# EAGLE design io (EAGLE 9.3.0)
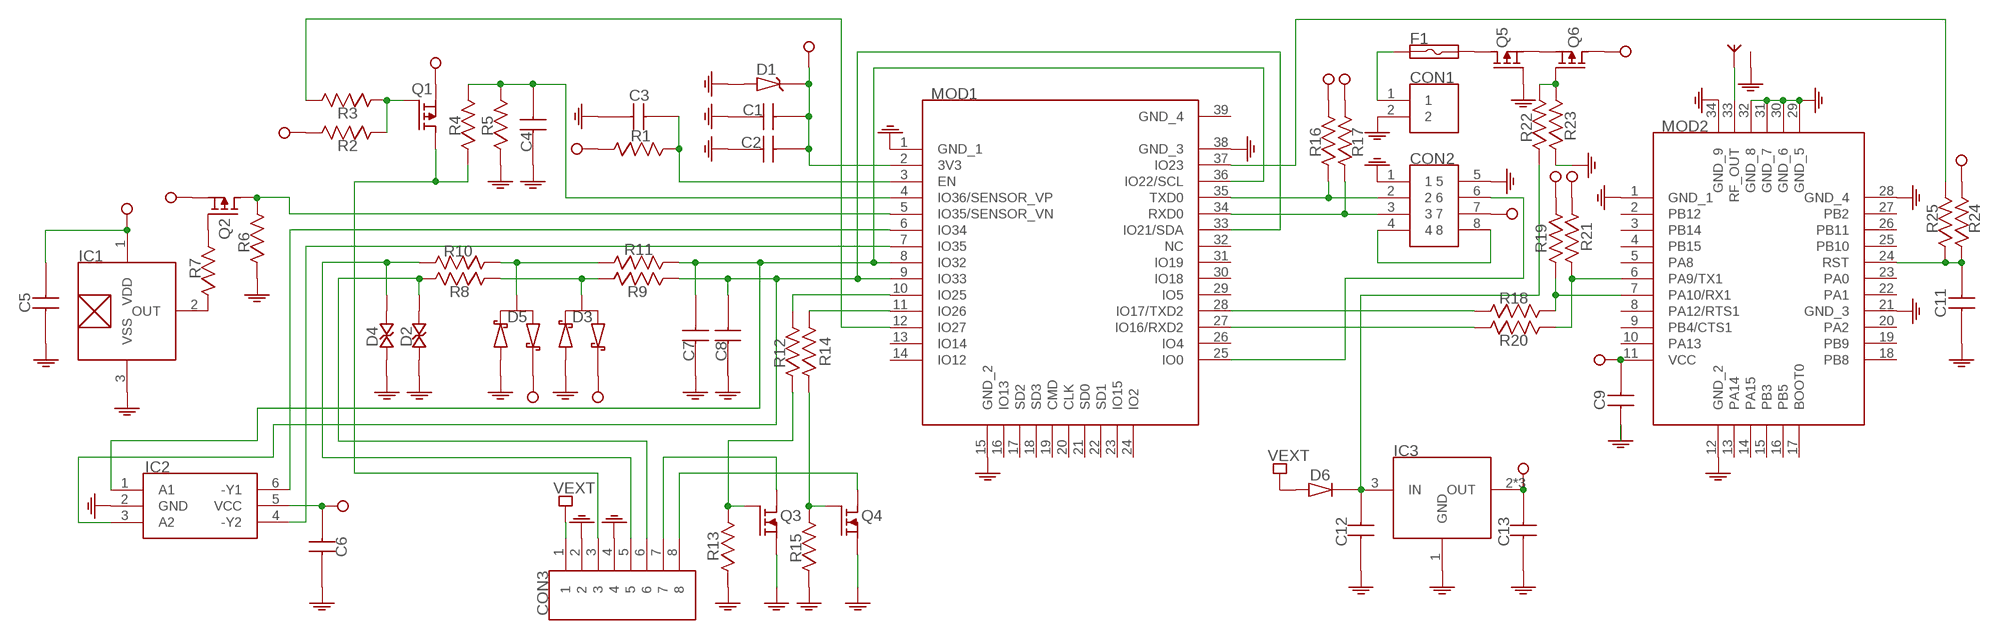
[diagram p0: schematic, sheet 1]

## Parts
ANT1  SMA-RF  [SMA-RF]
C1  CAPACITOR-0805  [0805]
C2  CAPACITOR-0603  [0603]
C3  CAPACITOR-0603  [0603]
C4  CAPACITOR-0603  [0603]
C5  CAPACITOR-0603  [0603]
C6  CAPACITOR-0603  [0603]
C7  CAPACITOR-0603  [0603]
C8  CAPACITOR-0603  [0603]
C9  CAPACITOR-0603  [0603]
C11  CAPACITOR-0603  [0603]
C12  CAPACITOR-0805  [0805]
C13  CAPACITOR-0805  [0805]
CON1  JST-PH-2-2.0MM  [JST-PH-2-2.0MM]
CON2  HEADER-8P-2R-DIP-2_0MM  [HEADER-8P-2R-DIP-2_0MM]
CON3  CON-89-3_81-PLUG  [CON-8P-3_81-PLUG]
D1  ZENER-SOD123  [SOD123-DIODE]
D2  TVS-DIODE-SMA  [DO-214AC-SMA]
D3  SCHOTTKY-SERIE-3P  [SOT23-3]
D4  TVS-DIODE-SMA  [DO-214AC-SMA]
D5  SCHOTTKY-SERIE-3P  [SOT23-3]
D6  DIODE-DO-214AC-SMA  [DO-214AC-SMA-DIODE]
F1  FUSE-0805  [0805]
IC1  S-5712-SOT23-3  [SOT23-3]
IC2  NL27WZ04DTT1G  [SOT23-6]
IC3  VREG-SOT-223  [SOT-223]
MOD1  ESP32-WROOM-32D  [ESP32-WROOM-32D]
MOD2  RAK811  [RAK811]
Q1  P-MOSFET  [SOT23-3]
Q2  P-MOSFET  [SOT23-3]
Q3  N-MOSFET  [SOT23-3]
Q4  N-MOSFET  [SOT23-3]
Q5  P-MOSFET  [SOT23-3]
Q6  P-MOSFET  [SOT23-3]
R1  RESISTOR-0603  [0603]
R2  RESISTOR-0603  [0603]
R3  RESISTOR-0603  [0603]
R4  RESISTOR-0603  [0603]
R5  RESISTOR-0603  [0603]
R6  RESISTOR-0603  [0603]
R7  RESISTOR-0603  [0603]
R8  RESISTOR-0805  [0805]
R9  RESISTOR-0603  [0603]
R10  RESISTOR-0805  [0805]
R11  RESISTOR-0603  [0603]
R12  RESISTOR-0603  [0603]
R13  RESISTOR-0603  [0603]
R14  RESISTOR-0603  [0603]
R15  RESISTOR-0603  [0603]
R16  RESISTOR-0603  [0603]
R17  RESISTOR-0603  [0603]
R18  RESISTOR-0603  [0603]
R19  RESISTOR-0603  [0603]
R20  RESISTOR-0603  [0603]
R21  RESISTOR-0603  [0603]
R22  RESISTOR-0603  [0603]
R23  RESISTOR-0603  [0603]
R24  RESISTOR-0603  [0603]
R25  RESISTOR-0603  [0603]

## Nets
GND: ANT1.2(GND) ANT1.3(GND) ANT1.4(GND) ANT1.5(GND) C1.1 C2.1 C3.1 C4.1 C5.1 C6.2 C7.1 C8.1 C9.1 C11.1 C12.1 C13.1 CON1.2 CON2.1 CON2.5 CON3.2 CON3.4 D1.2(A) D2.1 D3.1 D4.1 D5.1 IC1.3(VSS) IC2.2(GND) IC3.1(GND) MOD1.1(GND_1) MOD1.15(GND_2) MOD1.38(GND_3) MOD2.1(GND_1) MOD2.12(GND_2) MOD2.21(GND_3) MOD2.28(GND_4) MOD2.29(GND_5) MOD2.30(GND_6) MOD2.31(GND_7) MOD2.32(GND_8) MOD2.34(GND_9) Q3.2(S) Q4.2(S) Q5.1(G) R5.1 R6.1 R13.1 R15.1 R23.1
N$1: C3.2 MOD1.3(EN) R1.2
N$2: ANT1.1(ANT) MOD2.33(RF_OUT)
N$3: MOD2.6(PA9/TX1) R20.2 R21.2
N$4: MOD2.7(PA10/RX1) R18.2 R19.2
N$5: MOD1.37(IO23) R25.2
N$6: MOD1.28(IO17/TXD2) R18.1
N$7: MOD1.27(IO16/RXD2) R20.1
N$8: CON2.2 MOD1.35(TXD0) R16.1
N$9: CON2.3 MOD1.34(RXD0) R17.1
N$10: CON2.4 CON2.8
N$11: CON2.6 MOD1.25(IO0)
N$12: CON1.1 F1.1
N$13: MOD1.5(IO35/SENSOR_VN) Q2.3(D) R6.2
N$14: CON3.7 Q3.3(D)
N$15: C7.2 IC2.1(A1) MOD1.8(IO32) MOD1.36(IO22/SCL) R11.2
N$16: CON3.3 Q1.3(D) R4.1
N$17: C11.2 MOD2.24(RST) R24.1 R25.1
N$18: Q1.1(G) R2.1 R3.1
N$19: F1.2 Q5.3(D)
N$20: C8.2 IC2.3(A2) MOD1.9(IO33) MOD1.33(IO21/SDA) R9.2
N$21: Q2.1(G) R7.2
N$23: IC2.4(-Y2) MOD1.7(IO35)
N$24: D5.3 R10.1 R11.1
N$25: D3.3 R8.1 R9.1
N$26: MOD1.11(IO26) R14.2
N$27: MOD1.10(IO25) R12.2
N$28: Q4.1(G) R14.1 R15.2
N$29: IC2.6(-Y1) MOD1.6(IO34)
N$30: CON3.8 Q4.3(D)
N$31: Q5.2(S) Q6.2(S)
N$32: Q3.1(G) R12.1 R13.2
N$33: MOD1.12(IO27) R3.2
N$34: IC1.2(OUT) R7.1
N$36: C12.2 D6.1(K) IC3.3(IN) R22.1
N$37: Q6.1(G) R22.2 R23.2
N$38: C4.2 MOD1.4(IO36/SENSOR_VP) R4.2 R5.2
N$39: CON3.6 D2.2 R8.2
N$40: CON3.5 D4.2 R10.2
VCC: C1.2 C2.2 C5.2 C6.1 C9.2 C13.2 CON2.7 D1.1(K) D3.2 D5.2 IC1.1(VDD) IC2.5(VCC) IC3.2(OUT) IC3.4(OUT) IC3.5(OUT) MOD1.2(3V3) MOD2.11(VCC) Q1.2(S) Q2.2(S) Q6.3(D) R1.1 R2.2 R16.2 R17.2 R19.1 R21.1 R24.2
VEXT: CON3.1 D6.2(A)
Unconnected: MOD1.13(IO14) MOD1.14(IO12) MOD1.16(IO13) MOD1.17(SD2) MOD1.18(SD3) MOD1.19(CMD) MOD1.20(CLK) MOD1.21(SD0) MOD1.22(SD1) MOD1.23(IO15) MOD1.24(IO2) MOD1.26(IO4) MOD1.29(IO5) MOD1.30(IO18) MOD1.31(IO19) MOD1.32(NC) MOD2.2(PB12) MOD2.3(PB14) MOD2.4(PB15) MOD2.5(PA8) MOD2.8(PA12/RTS1) MOD2.9(PB4/CTS1) MOD2.10(PA13) MOD2.13(PA14) MOD2.14(PA15) MOD2.15(PB3) MOD2.16(PB5) MOD2.17(BOOT0) MOD2.18(PB8) MOD2.19(PB9) MOD2.20(PA2) MOD2.22(PA1) MOD2.23(PA0) MOD2.25(PB10) MOD2.26(PB11) MOD2.27(PB2)

## Power pins joined to a net without a drawn wire
GND_4: MOD1.39(GND_4)

## Library data of the parts
ANT1 = SamacSys_Parts:SMA-RF
C1 C12 C13 = SamacSys_Parts:CAPACITOR-0805
C2-C9 C11 = SamacSys_Parts:CAPACITOR-0603
CON1 = SamacSys_Parts:JST-PH-2-2.0MM
CON2 = SamacSys_Parts:HEADER-8P-2R-DIP-2_0MM
CON3 = SamacSys_Parts:CON-89-3_81-PLUG
D1 = SamacSys_Parts:ZENER-SOD123
D2 D4 = SamacSys_Parts:TVS-DIODE-SMA
D3 D5 = SamacSys_Parts:SCHOTTKY-SERIE-3P
D6 = SamacSys_Parts:DIODE-DO-214AC-SMA
F1 = SamacSys_Parts:FUSE-0805
IC1 = SamacSys_Parts:S-5712-SOT23-3
IC2 = SamacSys_Parts:NL27WZ04DTT1G
IC3 = SamacSys_Parts:VREG-SOT-223
MOD1 = SamacSys_Parts:ESP32-WROOM-32D
MOD2 = SamacSys_Parts:RAK811
Q1 Q2 Q5 Q6 = SamacSys_Parts:P-MOSFET
Q3 Q4 = SamacSys_Parts:N-MOSFET
R1-R7 R9 R11-R25 = SamacSys_Parts:RESISTOR-0603
R8 R10 = SamacSys_Parts:RESISTOR-0805

## Board
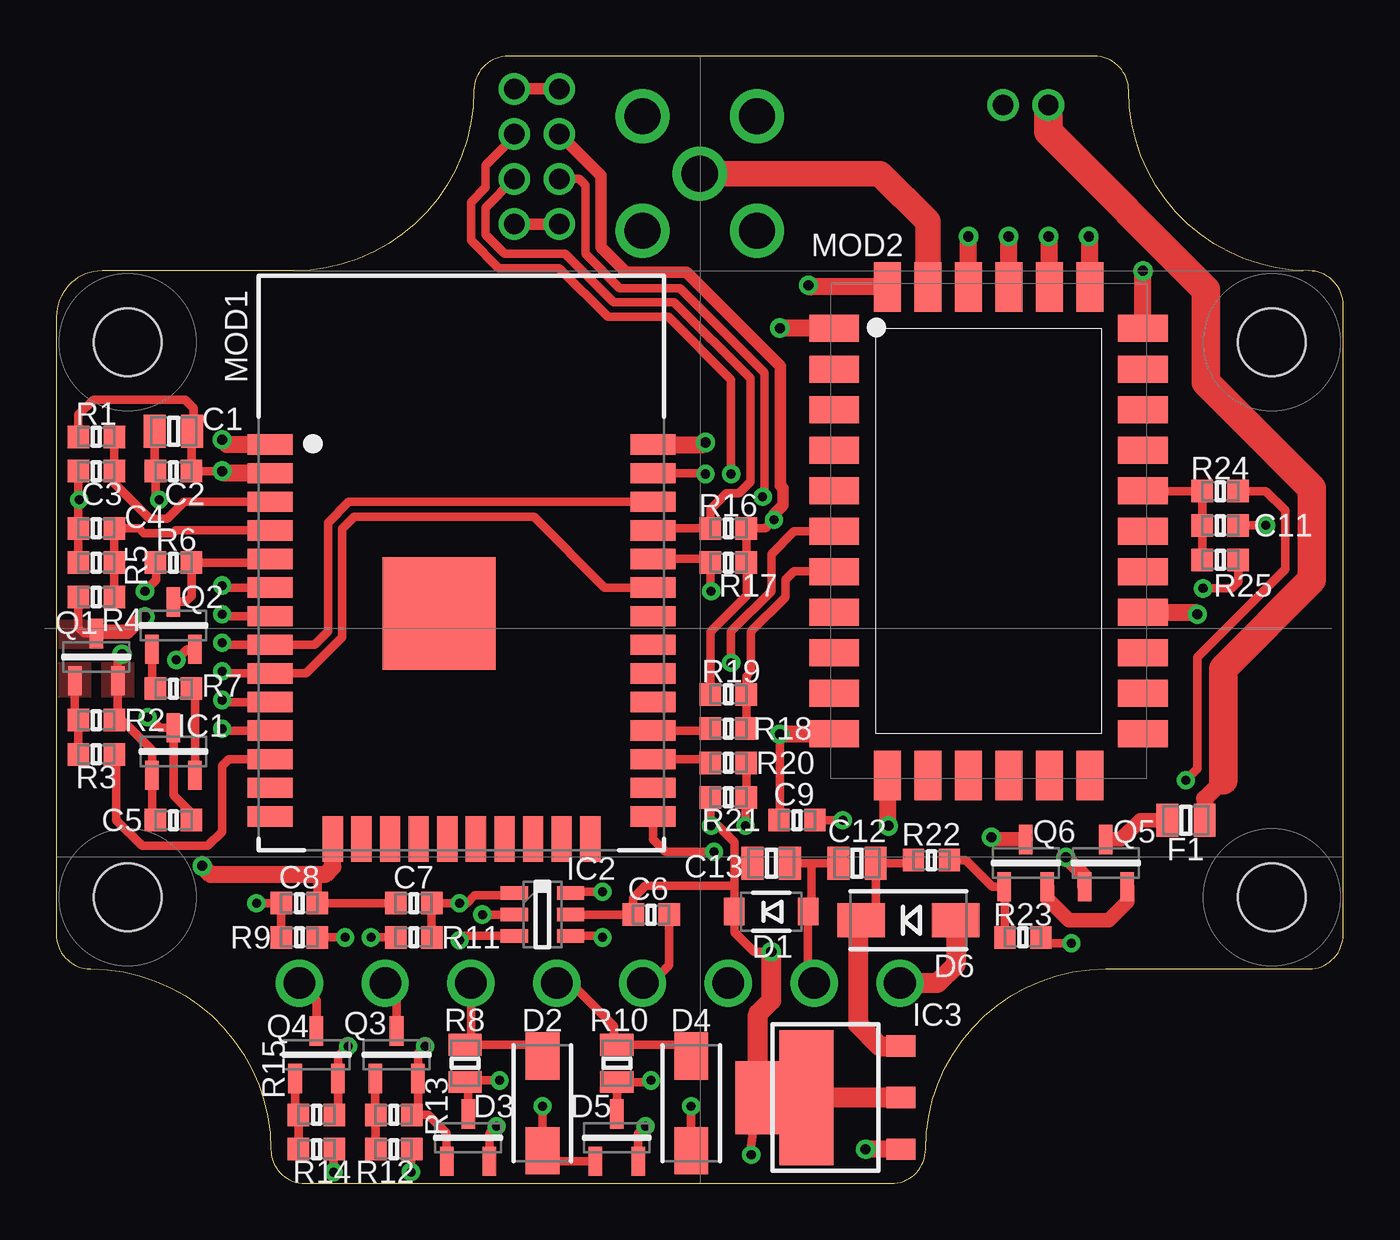
[diagram p1: board, top side]
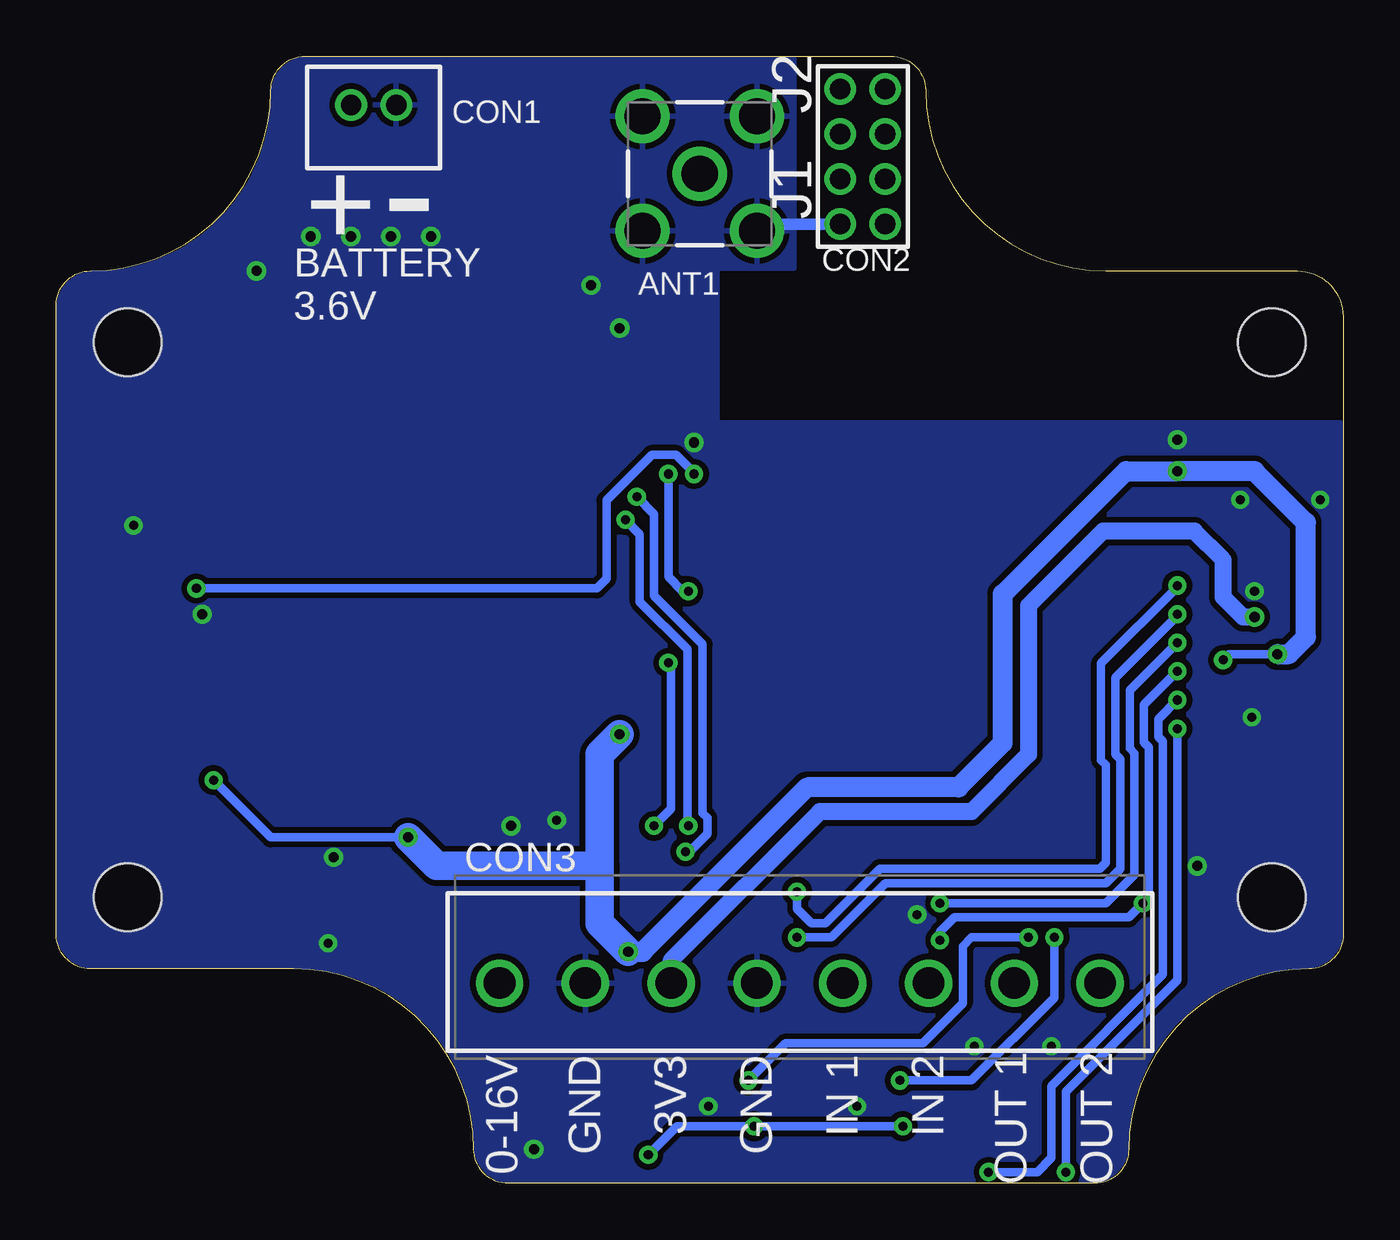
[diagram p2: board, bottom side, seen from below]

Size 57.15 x 50.04 mm. Coordinates in mm from the lower left corner, seen from the top.
Outline: 0,38.48 0,11.05 arc90 1.52,9.53 arc-90 9.53,1.52 arc90 11.05,0 37.08,0 arc90 38.61,1.52 arc-90 46.61,9.53 55.63,9.53 arc90 57.15,11.05 57.15,38.99 arc90 55.63,40.51 arc-90 47.62,48.51 arc90 46.1,50.04 20.07,50.04 arc90 18.54,48.51 arc-90 10.54,40.51 2.03,40.51 arc90 0,38.48
Copper layers (1*16): Top 0.035mm / dielectric 1.5mm / Bottom 0.035mm
Design rules "default": minimum track width 15mil, minimum drill 0.35mm, track to track 10mil, track to pad 10mil, pad to pad 10mil, via to via 10mil, smd to smd 0mil, copper to edge 0mil, drill to drill 6mil, minimum pad ring 10mil, minimum via ring 8mil, stop-mask expansion 4mil, vias tented up to drill 25mil, thermal gap 10mil
Holes 3 mm at 3.17,37.34 53.98,37.34 53.98,12.7 3.17,12.7

### Footprints (pad centres in the part's own frame; a part is rotated, then mirrored left to right if it is on the bottom)
SMA-RF = drill 1.6: 1 0,0; 2 -2.54,2.54; 3 -2.54,-2.54; 4 2.54,-2.54; 5 2.54,2.54
0805 = smd 0.97 x 1.47: 1 -0.83,0; 2 0.83,0
0603 = smd 0.95 x 1: 1 -0.8,0; 2 0.8,0
JST-PH-2-2.0MM = drill 0.9: 1 -1,0; 2 1,0
HEADER-8P-2R-DIP-2_0MM = drill 0.9: 1 -3,-1; 2 -1,-1; 3 1,-1; 4 3,-1; 5 -3,1; 6 -1,1; 7 1,1; 8 3,1
CON-8P-3_81-PLUG = drill 1.4: 1 -13.335,0; 2 -9.525,0; 3 -5.715,0; 4 -1.905,0; 5 1.905,0; 6 5.715,0; 7 9.525,0; 8 13.335,0
SOD123-DIODE = smd 0.91 x 1.22: 1 -1.635,0; 2 1.635,0
DO-214AC-SMA = smd 2.1 x 1.5: 1 -2.1,0; 2 2.1,0
SOT23-3 = smd 1.3 x 0.6: 1 -1.05,0.95; 2 -1.05,-0.95; 3 1.05,0
DO-214AC-SMA-DIODE = smd 2.1 x 1.5: 1 -2.1,0; 2 2.1,0
SOT23-6 = smd 1.2 x 0.6: 1 -1.25,0.95; 2 -1.25,0; 3 -1.25,-0.95; 4 1.25,-0.95; 5 1.25,0; 6 1.25,0.95
SOT-223 = smd 1.3 x 0.95: 1 -3.35,2.29; 2 -3.35,0; 3 -3.35,-2.29 | smd 2 x 3.25: 4 3,0 | smd 2.4 x 6: 5 0.85,0
ESP32-WROOM-32D = smd 2 x 0.9: 1 -8.537,8.292; 2 -8.537,7.022; 3 -8.537,5.752; 4 -8.537,4.482; 5 -8.537,3.212; 6 -8.537,1.942; 7 -8.537,0.672; 8 -8.537,-0.598; 9 -8.537,-1.868; 10 -8.537,-3.138; 11 -8.537,-4.408; 12 -8.537,-5.678; 13 -8.537,-6.948; 14 -8.537,-8.218; 25 8.463,-8.218; 26 8.463,-6.948; 27 8.463,-5.678; 28 8.463,-4.408; 29 8.463,-3.138; 30 8.463,-1.868; 31 8.463,-0.598; 32 8.463,0.672; 33 8.463,1.942; 34 8.463,3.212; 35 8.463,4.482; 36 8.463,5.752; 37 8.463,7.022; 38 8.463,8.292 | smd 0.9 x 2: 15 -5.752,-9.218; 16 -4.482,-9.218; 17 -3.212,-9.218; 18 -1.942,-9.218; 19 -0.672,-9.218; 20 0.598,-9.218; 21 1.868,-9.218; 22 3.138,-9.218; 23 4.408,-9.218; 24 5.678,-9.218 | smd 5 x 5: 39 -1.037,0.792
RAK811 = smd 2.2 x 1.2: 1 -6.85,9; 2 -6.85,7.2; 3 -6.85,5.4; 4 -6.85,3.6; 5 -6.85,1.8; 6 -6.85,0; 7 -6.85,-1.8; 8 -6.85,-3.6; 9 -6.85,-5.4; 10 -6.85,-7.2; 11 -6.85,-9; 18 6.85,-9; 19 6.85,-7.2; 20 6.85,-5.4; 21 6.85,-3.6; 22 6.85,-1.8; 23 6.85,0; 24 6.85,1.8; 25 6.85,3.6; 26 6.85,5.4; 27 6.85,7.2; 28 6.85,9 | smd 1.2 x 2.2: 12 -4.5,-10.85; 13 -2.7,-10.85; 14 -0.9,-10.85; 15 0.9,-10.85; 16 2.7,-10.85; 17 4.5,-10.85; 29 4.5,10.85; 30 2.7,10.85; 31 0.9,10.85; 32 -0.9,10.85; 33 -2.7,10.85; 34 -4.5,10.85

### Placement (x,y rotation side)
ANT1  28.57,44.83 0 bottom
C1  5.21,33.4 0 top
C2  5.21,31.62 0 top
C3  1.78,31.62 0 top
C4  1.78,29.08 0 top
C5  5.21,16.13 180 top
C6  26.42,11.94 0 top
C7  15.88,12.45 0 top
C8  10.79,12.45 180 top
C9  32.89,16.13 180 top
C11  51.69,29.21 180 top
C12  35.56,14.22 0 top
C13  31.75,14.22 180 top
CON1  43.05,47.88 0 bottom
CON2  21.34,45.59 90 bottom
CON3  24.13,8.89 0 bottom
D1  31.75,12.06 0 top
D2  21.59,3.56 90 top
D3  18.29,2.03 90 top
D4  28.19,3.56 90 top
D5  24.89,2.03 90 top
D6  37.85,11.68 0 top
F1  50.16,16.13 180 top
IC1  5.21,19.18 90 top
IC2  21.59,11.94 0 top
IC3  34.16,3.81 180 top
MOD1  18.03,24.51 0 top
MOD2  41.4,28.96 0 top
Q1  1.78,23.37 90 top
Q2  5.21,24.77 90 top
Q3  15.11,5.71 90 top
Q4  11.56,5.71 90 top
Q5  46.61,14.22 90 top
Q6  43.05,14.22 90 top
R1  1.78,33.15 0 top
R2  1.78,20.57 0 top
R3  1.78,19.05 0 top
R4  1.78,26.04 0 top
R5  1.78,27.56 0 top
R6  5.21,27.56 0 top
R7  5.21,21.97 180 top
R8  18.16,5.33 90 top
R9  10.79,10.92 180 top
R10  24.89,5.33 90 top
R11  15.88,10.92 0 top
R12  14.99,1.52 0 top
R13  14.99,3.05 180 top
R14  11.56,1.52 0 top
R15  11.56,3.05 180 top
R16  29.84,29.08 0 top
R17  29.84,27.56 0 top
R18  29.84,20.19 0 top
R19  29.84,21.72 0 top
R20  29.84,18.67 0 top
R21  29.84,17.14 0 top
R22  38.86,14.35 0 top
R23  42.93,10.92 180 top
R24  51.69,30.73 0 top
R25  51.69,27.69 0 top

### Tracks (layer width: path | path; a pad name or v marks a point on that pad's centre or on a via)
GND  (via drill 0.4, 0.45)
  Top 0.381: R5.1 C4.1 0.98,30.39 | C1.1 4.38,31.65 C2.1 4.41,30.52 v4.57,30.35 | R15.1 12.51,3.2 Q4.2 12.51,5.65 v12.95,6.1 | C7.1 C8.1 11.6,13.72 | IC2.2 v18.92,11.94 | C6.2 27.22,9.69 26.42,8.89 CON3.4 | CON3.2 33.38,9.16 D1.2 33.53,12.21 33.53,14.22 | C3.1 0.98,30.39 | 0.98,30.39 v1.02,30.35 | R6.1 4.45,27.52 4.45,26.8 v3.94,26.29 | C5.1 6.01,16.44 5.21,17.24 IC1.3 4.59,20.23 4.42,20.41 4.36,20.41 v4.06,20.7 | MOD2.1 35.16,37.96 35.31,38.1 | v16.38,6.1 16.06,5.78 Q3.2 16.06,3.33 R13.1 16.51,3.05 17.34,2.22 D3.1 | D5.1 22.06,0.98 D2.1 v21.59,3.43 | D4.1 v28.19,3.43 | v34.92,16.13 C9.1 | C13.1 33.53,14.22 | 33.53,14.22 C12.1 | C11.1 v53.72,29.21 | R23.1 43.98,10.67 v45.09,10.67
  Top 0.508: CON2.1 CON2.5
  Top 0.635: Q5.1 45.66,13.65 v44.83,14.48
  Top 0.762: MOD1.1 7.58,32.8 v7.37,33.02 | v6.48,14.1 6.86,13.72 11.6,13.72 11.94,13.72 12.28,14.06 MOD1.15 | MOD1.38 28.74,32.8 v28.83,32.89 | IC3.1 v35.95,1.52 v35.94,1.52 | MOD2.12 36.9,15.93 v36.96,15.88 | MOD2.1 34.53,37.97 v32.13,37.97 | MOD2.34 33.47,39.81 v33.4,39.88 | v48.26,40.51 v48.25,40.51 MOD2.28 | MOD2.21 50.59,25.36 v50.67,25.27 | MOD2.32 40.5,42.03 v40.51,42.04 | MOD2.31 42.3,42.03 v42.29,42.04 | MOD2.30 44.1,42 v44.07,42.04 | MOD2.29 45.9,41.98 v45.85,42.04
  Bottom 0.508: CON2.5 25.73,42.59 ANT1.4
  pour Bottom: 1.65,9.65 arc-90 0.13,11.18 0.13,33.78 27.81,33.78 27.81,40.64 24.38,40.64 24.38,49.91 45.97,49.91 arc-90 47.5,48.39 arc90 55.5,40.39 arc-90 57.02,38.86 57.02,11.18 arc-90 55.5,9.65 46.48,9.65 arc90 38.48,1.65 arc-90 36.96,0.13 11.18,0.13 arc-90 9.65,1.65 arc90
N$1
  Top 0.381: R1.2 C3.2 2.58,31.08 4.15,29.5 4.92,29.5 5.68,30.26 MOD1.3
N$2
  Top 1.143: MOD2.33 38.7,42.71 36.58,44.83 ANT1.1
N$3  (via drill 0.4)
  Top 0.381: R20.2 R21.2 30.61,17.11 v30.61,15.88 | v29.97,23.11 29.97,24.52 31.75,26.3 31.75,27.94 32.77,28.96 MOD2.6
  Bottom 0.381: v29.97,23.11 29.84,22.99 29.84,16.64 v30.61,15.88
N$4
  Top 0.381: R18.2 R19.2 30.64,22.52 30.86,22.73 30.86,24.51 32.38,26.04 32.38,26.8 32.77,27.18 34.53,27.18 MOD2.7
N$5  (via drill 0.4)
  Top 0.381: R25.2 52.49,26.71 52.2,26.42 v50.93,26.42 | MOD1.37 28.79,31.53 v28.83,31.5
  Bottom 0.381: v28.83,31.5 28.83,31.55 29.62,32.34 30.7,32.34 32.73,30.32 32.73,26.84 33.15,26.42 v50.93,26.42
N$6
  Top 0.381: MOD1.28 28.95,20.1 R18.1
N$7
  Top 0.381: MOD1.27 28.88,18.83 R20.1
N$8
  Top 0.381: MOD1.35 26.59,29.08 R16.1 29.05,29.93 29.76,30.65 30.32,30.65 30.82,31.14 30.82,35.74 27.44,39.12 24.76,39.12 22.6,41.27 19.9,41.27 19.06,42.12 19.06,43.32 CON2.2
N$9  (via drill 0.4)
  Top 0.381: v29.08,26.29 29.05,26.33 R17.1 28.88,27.72 MOD1.34 | v29.97,31.5 29.97,35.69 27.18,38.48 24.49,38.48 22.33,40.64 19.64,40.64 18.41,41.87 18.41,43.57 19.06,44.22 19.06,45.2 20.34,46.47 CON2.3
  Bottom 0.381: v29.97,31.5 29.97,26.92 29.34,26.29 v29.08,26.29
N$10
  Top 0.508: CON2.4 CON2.8
N$11  (via drill 0.4)
  Top 0.381: v29.21,14.73 27.05,14.73 26.5,15.29 MOD1.25 | CON2.6 23.23,44.59 23.5,44.32 23.5,41.27 25.02,39.75 27.7,39.75 31.45,36 31.45,30.57 v31.37,30.48
  Bottom 0.381: v29.21,14.73 29.03,14.73 28.23,15.52 28.23,16.23 28.45,16.44 28.45,23.93 30.61,26.09 30.61,29.72 v31.37,30.48
N$12
  Top 0.762: 51.82,17.91 50.99,17.09 F1.1
  Top 1.27: CON1.1 44.05,46.68 51.05,39.68 51.05,35.56 55.75,30.86 55.75,26.8 51.82,22.86 51.82,17.91
N$13
  Top 0.381: MOD1.5 9.33,27.56 R6.2 6.01,26.07 5.75,25.82 Q2.3
N$14
  Top 0.381: Q3.3 15.11,8.38 CON3.7
N$15  (via drill 0.4)
  Top 0.381: v7.37,24 7.46,23.91 MOD1.8 11.47,23.91 12.06,24.51 12.06,29.34 12.99,30.26 MOD1.36 | R11.2 C7.2 v17.91,12.45 18.23,12.45 18.57,12.79 20.24,12.79 IC2.1
  Bottom 0.381: v17.91,12.45 10.54,12.45 9.27,13.72 9.27,19.1 9.48,19.32 9.48,21.89 v7.37,24
N$16  (via drill 0.45)
  Top 0.381: Q1.3 1.24,24.42 0.98,24.68 R4.1
  Top 0.635: Q1.3 1.85,24.5 3.16,24.5 3.81,25.15 v3.94,25.15
  Bottom 0.762: v3.94,25.15 4.45,25.15 5.33,26.04 5.33,27.69 6.6,28.96 10.67,28.96 13.97,25.65 13.97,19.05 16.51,16.51 23.24,16.51 29.84,9.91 CON3.3
  pour Top (no thermals): 0.13,25.02 2.03,25.02 2.03,23.75 0.13,23.75
N$17
  Top 0.381: MOD2.24 48.27,30.73 R24.1 C11.2 R25.1
N$18
  Top 0.381: R3.1 R2.1 0.83,20.72 Q1.1
  pour Top (no thermals): 0.13,23.11 1.52,23.11 1.52,21.59 0.13,21.59
N$19
  Top 0.635: Q5.3 47.28,15.27 48.13,16.13 F1.2
N$20  (via drill 0.4)
  Top 0.381: v7.37,22.73 7.46,22.64 MOD1.9 11.1,22.64 12.7,24.25 12.7,29.07 13.22,29.59 21.21,29.59 24.35,26.45 MOD1.33 | R9.2 C8.2 v8.89,12.45 | IC2.3 18.1,10.99 v17.91,10.79
  Bottom 0.381: v7.37,22.73 8.85,21.25 8.85,19.58 8.64,19.37 8.64,12.7 v8.89,12.45 9.53,11.81 17.27,11.81 17.91,11.18 v17.91,10.79
N$21
  Top 0.381: Q2.1 4.26,22.12 R7.2
N$23  (via drill 0.4)
  Top 0.381: MOD1.7 7.46,25.18 v7.37,25.27 | IC2.4 24.19,10.99 v24.26,10.92
  Bottom 0.381: v24.26,10.92 22.73,10.92 20.32,13.34 10.55,13.34 9.91,13.98 9.91,18.84 10.12,19.05 10.12,22.45 7.37,25.2 v7.37,25.27
N$24  (via drill 0.4)
  Top 0.381: D5.3 R10.1 26.35,4.5 v26.42,4.57 | R11.1 v13.97,10.92
  Bottom 0.381: v26.42,4.57 24.77,6.22 18.67,6.22 16.89,8 16.89,10.54 16.51,10.92 v13.97,10.92
N$25  (via drill 0.4)
  Top 0.381: D3.3 18.29,4.38 R8.1 18.23,4.57 v19.68,4.57 | R9.1 v12.83,10.92
  Bottom 0.381: v19.68,4.57 16.51,4.57 12.83,8.26 v12.83,10.92
N$26  (via drill 0.4)
  Top 0.381: R14.2 12.32,1.49 v12.32,0.51 | MOD1.11 7.46,20.1 v7.37,20.19
  Bottom 0.381: v7.37,20.19 7.37,9.02 12.32,4.06 v12.32,0.51
N$27  (via drill 0.4)
  Top 0.381: R12.2 15.75,1.49 v15.75,0.51 | MOD1.10 7.46,21.37 v7.37,21.46
  Bottom 0.381: v7.37,21.46 8.21,20.61 8.21,19.84 8,19.63 8,9.28 12.95,4.33 12.95,1.14 13.59,0.51 v15.75,0.51
N$28
  Top 0.381: Q4.1 10.61,3.2 R15.2 R14.1
N$29  (via drill 0.4)
  Top 0.381: MOD1.6 7.46,26.45 v7.37,26.54 | IC2.6 22.91,12.95 v24.26,12.95
  Bottom 0.381: v24.26,12.95 24.26,12.19 23.62,11.56 23,11.56 20.58,13.97 10.81,13.97 10.55,14.23 10.55,18.59 10.75,18.79 10.75,23.08 7.37,26.47 v7.37,26.54
N$30
  Top 0.381: Q4.3 11.56,8.13 CON3.8
N$31
  Top 0.635: Q6.2 44,12.64 44.96,11.68 46.74,11.68 47.56,12.51 Q5.2
N$32
  Top 0.381: Q3.1 14.16,3.07 R13.2 R12.1
N$33
  Top 0.381: MOD1.12 7.66,18.83 7.37,18.54 7.37,15.62 6.73,14.99 3.81,14.99 2.67,16.13 2.67,18.96 R3.2
N$34
  Top 0.381: IC1.2 6.16,21.82 R7.1
N$36
  Top 0.381: R22.1 37.94,14.22 C12.2 36.39,12.13 35.94,11.68 D6.1
  Top 0.889: D6.1 35.59,11.53 35.59,7.08 36.57,6.1 IC3.3
N$37
  Top 0.381: R23.2 42.13,13.15 Q6.1 41.56,13.17 40.39,14.35 R22.2
N$38
  Top 0.381: R4.2 R5.2 C4.2 3.67,29.08 3.89,28.87 5.19,28.87 5.31,28.99 MOD1.4
N$39
  Top 0.381: D2.2 21.08,6.16 R8.2 18.41,6.42 CON3.6
N$40
  Top 0.381: D4.2 27.69,6.16 R10.2 24.77,6.29 24.77,6.99 22.86,8.89 CON3.5
VCC  (via drill 0.4, 0.45)
  Top 0.381: C5.2 4.26,16.28 IC1.1 4.26,19.24 2.77,20.72 2.73,20.72 | 2.73,20.72 Q1.2 2.73,23.3 v2.92,23.5 | 2.73,20.72 R2.2 | IC2.5 C6.1 25.62,12.66 26.16,13.21 30.11,13.21 | R21.1 29.05,15.91 v29.08,15.88 29.39,15.88 30.11,15.15 30.11,14.22 | R19.1 29.05,24.49 30.66,26.11 30.66,27.54 R17.2 R16.2 31.5,29.08 v31.88,29.46 | v7.37,31.62 C2.2 6.01,33.37 C1.2 6.1,33.46 6.1,34.42 5.71,34.8 1.65,34.8 0.98,34.12 R1.1 | Q2.2 5.81,23.71 v5.33,23.24 | D3.2 19.24,2.22 v19.56,2.54 | D5.2 25.84,2.22 v26.16,2.54 | IC3.4 30.81,1.32 v30.86,1.27 | v32.13,19.94 32.13,16.17 C9.2 | 30.11,14.22 30.11,13.21 | 30.11,13.21 D1.1 30.11,11.16 30.99,10.29 v31.75,10.29 | C13.2 30.11,14.22 | R24.2 53.72,30.73 54.57,29.89 54.57,27.26 50.67,23.37 50.67,18.41 v50.16,17.91
  Top 0.508: CON2.7 24.19,44.74 24.19,41.56 25.31,40.45 27.99,40.45 32.15,36.29 32.15,30.98 32.28,30.86 32.28,30.1 31.88,29.7 v31.88,29.46
  Top 0.635: Q6.3 41.62,15.27 v41.53,15.37
  Top 0.762: MOD1.2 7.46,31.53 v7.37,31.62 | MOD2.11 34.53,19.94 v32.13,19.94
  Top 0.889: IC3.2 IC3.5 IC3.4 31.16,7.54 31.75,8.13 v31.75,10.29
  Bottom 0.381: v30.86,1.27 29.59,2.54 v26.16,2.54 v19.56,2.54 | v2.92,23.5 5.08,23.5 v5.33,23.24 | v41.53,15.37 47.62,15.37 v50.16,17.91 | v29.08,15.88 29.12,15.92 29.12,23.71 31.24,25.83 31.24,28.83 v31.88,29.46
  Bottom 0.889: v2.92,23.5 2.41,23.5 1.65,24.26 1.65,29.34 3.94,31.62 v7.37,31.62 9.65,31.62 15.11,26.16 15.11,19.56 17.08,17.59 23.81,17.59 31.11,10.29 v31.75,10.29
  Bottom 1.27: v32.13,19.94 33.02,19.05 33.02,14.1 | v41.53,15.37 40.26,14.1 33.02,14.1 | 33.02,14.1 33.02,11.56 v31.75,10.29
  pour Top (no thermals): 2.03,23.11 3.43,23.11 3.43,21.59 2.03,21.59
VEXT
  Top 0.889: D6.2 39.95,9.72 39.12,8.89 CON3.1

### Text on the board
tNames: MOD2
bNames: J2 | J1 | - | + | BATTERY / 3.6V | OUT 2 | OUT 1 | IN 2 | IN 1 | GND | 3V3 | GND | 0-16V